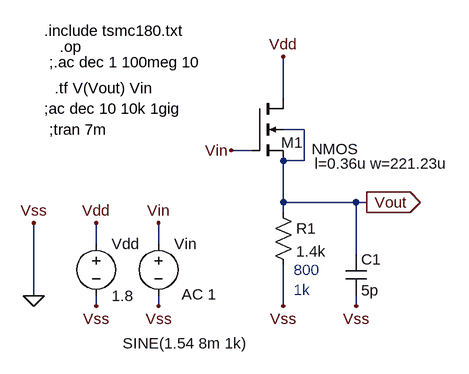
[diagram p0: schematic CD_amp_with_Rout_50.asc]
CD_amp_with_Rout_50.asc, the LTspice schematic file:
Version 4
SHEET 1 1164 680
WIRE 432 96 432 32
WIRE 464 144 432 144
WIRE 384 176 352 176
WIRE 464 192 464 144
WIRE 464 192 432 192
WIRE 432 256 432 192
WIRE 544 256 432 256
WIRE 560 256 544 256
WIRE 432 272 432 256
WIRE 144 320 144 288
WIRE 240 320 240 288
WIRE 544 336 544 256
WIRE 48 400 48 288
WIRE 144 416 144 400
WIRE 240 416 240 400
WIRE 432 416 432 352
WIRE 544 416 544 400
FLAG 48 400 0
FLAG 48 288 Vss
FLAG 240 288 Vin
FLAG 144 416 Vss
FLAG 240 416 Vss
FLAG 144 288 Vdd
FLAG 432 32 Vdd
FLAG 352 176 Vin
FLAG 432 416 Vss
FLAG 560 256 Vout
IOPIN 560 256 Out
FLAG 544 416 Vss
SYMBOL nmos4 384 96 R0
WINDOW 0 45 68 Left 2
WINDOW 3 92 78 Left 2
WINDOW 123 96 100 Left 2
SYMATTR InstName M1
SYMATTR Value2 l=0.36u w=221.23u
SYMBOL voltage 144 304 R0
WINDOW 123 0 0 Left 0
WINDOW 39 0 0 Left 0
SYMATTR InstName Vdd
SYMATTR Value 1.8
SYMBOL voltage 240 304 R0
WINDOW 3 -55 169 Left 2
WINDOW 123 36 94 Left 2
WINDOW 39 0 0 Left 0
SYMATTR Value SINE(1.54 8m 1k)
SYMATTR Value2 AC 1
SYMATTR InstName Vin
SYMBOL cap 528 336 R0
SYMATTR InstName C1
SYMATTR Value 5p
SYMBOL res 416 256 R0
SYMATTR InstName R1
SYMATTR Value 1.4k
TEXT 64 -8 Left 2 !.include tsmc180.txt
TEXT 88 16 Left 2 !.op
TEXT 72 40 Left 2 !;.ac dec 1 100meg 10
TEXT 80 80 Left 2 !.tf V(Vout) Vin
TEXT 72 144 Left 2 !;tran 7m
TEXT 64 112 Left 2 !;ac dec 10 10k 1gig
TEXT 448 360 Left 2 ;800\n1k

The netlist it stands for:
* CD_amp_with_Rout_50.asc
M1 Vdd Vin Vout Vout NMOS l=0.36u w=221.23u
Vdd Vdd 0 1.8
Vin Vin 0 SINE(1.54 8m 1k) AC 1
C1 Vout 0 5p
R1 Vout 0 1.4k
.model NMOS NMOS
.model PMOS PMOS
.lib standard.mos
.include tsmc180.txt
.op
;.ac dec 1 100meg 10
.tf V(Vout) Vin
;tran 7m
;ac dec 10 10k 1gig
* 800
* 1k
.backanno
.end